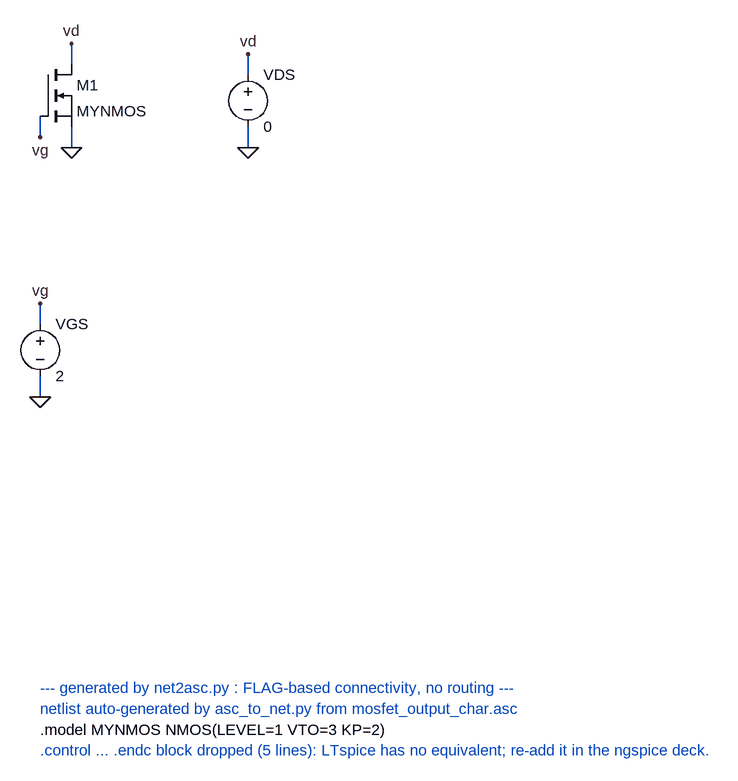
[diagram p0: schematic mosfet_output_char.asc]
mosfet_output_char.asc, the LTspice schematic file:
Version 4
SHEET 1 880 1256
WIRE 48 0 48 -32
WIRE 0 80 0 112
WIRE 48 96 48 128
WIRE 320 16 320 -16
WIRE 320 96 320 128
WIRE 0 400 0 368
WIRE 0 480 0 512
FLAG 48 -32 vd
FLAG 0 112 vg
FLAG 48 128 0
FLAG 320 -16 vd
FLAG 320 128 0
FLAG 0 368 vg
FLAG 0 512 0
SYMBOL nmos 0 0 R0
SYMATTR InstName M1
SYMATTR Value MYNMOS
SYMBOL voltage 320 0 R0
SYMATTR InstName VDS
SYMATTR Value 0
SYMBOL voltage 0 384 R0
SYMATTR InstName VGS
SYMATTR Value 2
TEXT 0 960 Left 2 ;--- generated by net2asc.py : FLAG-based connectivity, no routing ---
TEXT 0 992 Left 2 ;netlist auto-generated by asc_to_net.py from mosfet_output_char.asc
TEXT 0 1024 Left 2 !.model MYNMOS NMOS(LEVEL=1 VTO=3 KP=2)
TEXT 0 1056 Left 2 ;.control ... .endc block dropped (5 lines): LTspice has no equivalent; re-add it in the ngspice deck.

The netlist it stands for:
* mosfet_output_char.asc
M1 vd vg 0 0 MYNMOS
VDS vd 0 0
VGS vg 0 2
.model NMOS NMOS
.model PMOS PMOS
.lib standard.mos
* --- generated by net2asc.py : FLAG-based connectivity, no routing ---
* netlist auto-generated by asc_to_net.py from mosfet_output_char.asc
.model MYNMOS NMOS(LEVEL=1 VTO=3 KP=2)
* .control ... .endc block dropped (5 lines): LTspice has no equivalent; re-add it in the ngspice deck.
.backanno
.end